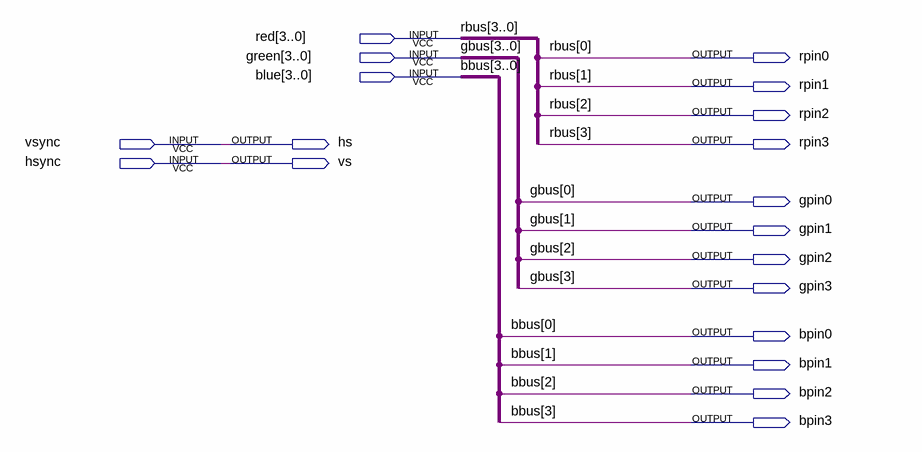
[diagram p0: schematic sheet]
// Quartus schematic block_name.bdf as structural Verilog: 0 symbols, 19 pins
module block_name (
  input  [3:0] red,
  input  [3:0] green,
  input  [3:0] blue,
  input  vsync,
  input  hsync,
  output rpin0,
  output rpin1,
  output rpin2,
  output hs,
  output rpin3,
  output vs,
  output gpin0,
  output gpin1,
  output gpin2,
  output gpin3,
  output bpin0,
  output bpin1,
  output bpin2,
  output bpin3
);


  assign bpin0 = blue[0];
  assign bpin1 = blue[1];
  assign bpin2 = blue[2];
  assign bpin3 = blue[3];
  assign gpin0 = green[0];
  assign gpin1 = green[1];
  assign gpin2 = green[2];
  assign gpin3 = green[3];
  assign hs = vsync;
  assign rpin0 = red[0];
  assign rpin1 = red[1];
  assign rpin2 = red[2];
  assign rpin3 = red[3];
  assign vs = hsync;

  // Other names for the same wires on the sheet: bbus[3:0] = blue; gbus[3:0] = green; rbus[3:0] = red
endmodule
